# EasyEDA Pro project ProPrj_ProDocument_Button_Board_v3.0_2024-08-01_2024-12-14.epro

# Schematic Button_Board
Create Date: 2024-07-05; Page Name: P1; Project Name: MaiPico_IO_mini; Schematic Name: Button_Board; Update Date: 2024-07-05; Company: 嘉立创EDA; Page Size: A4; Version: V1.0
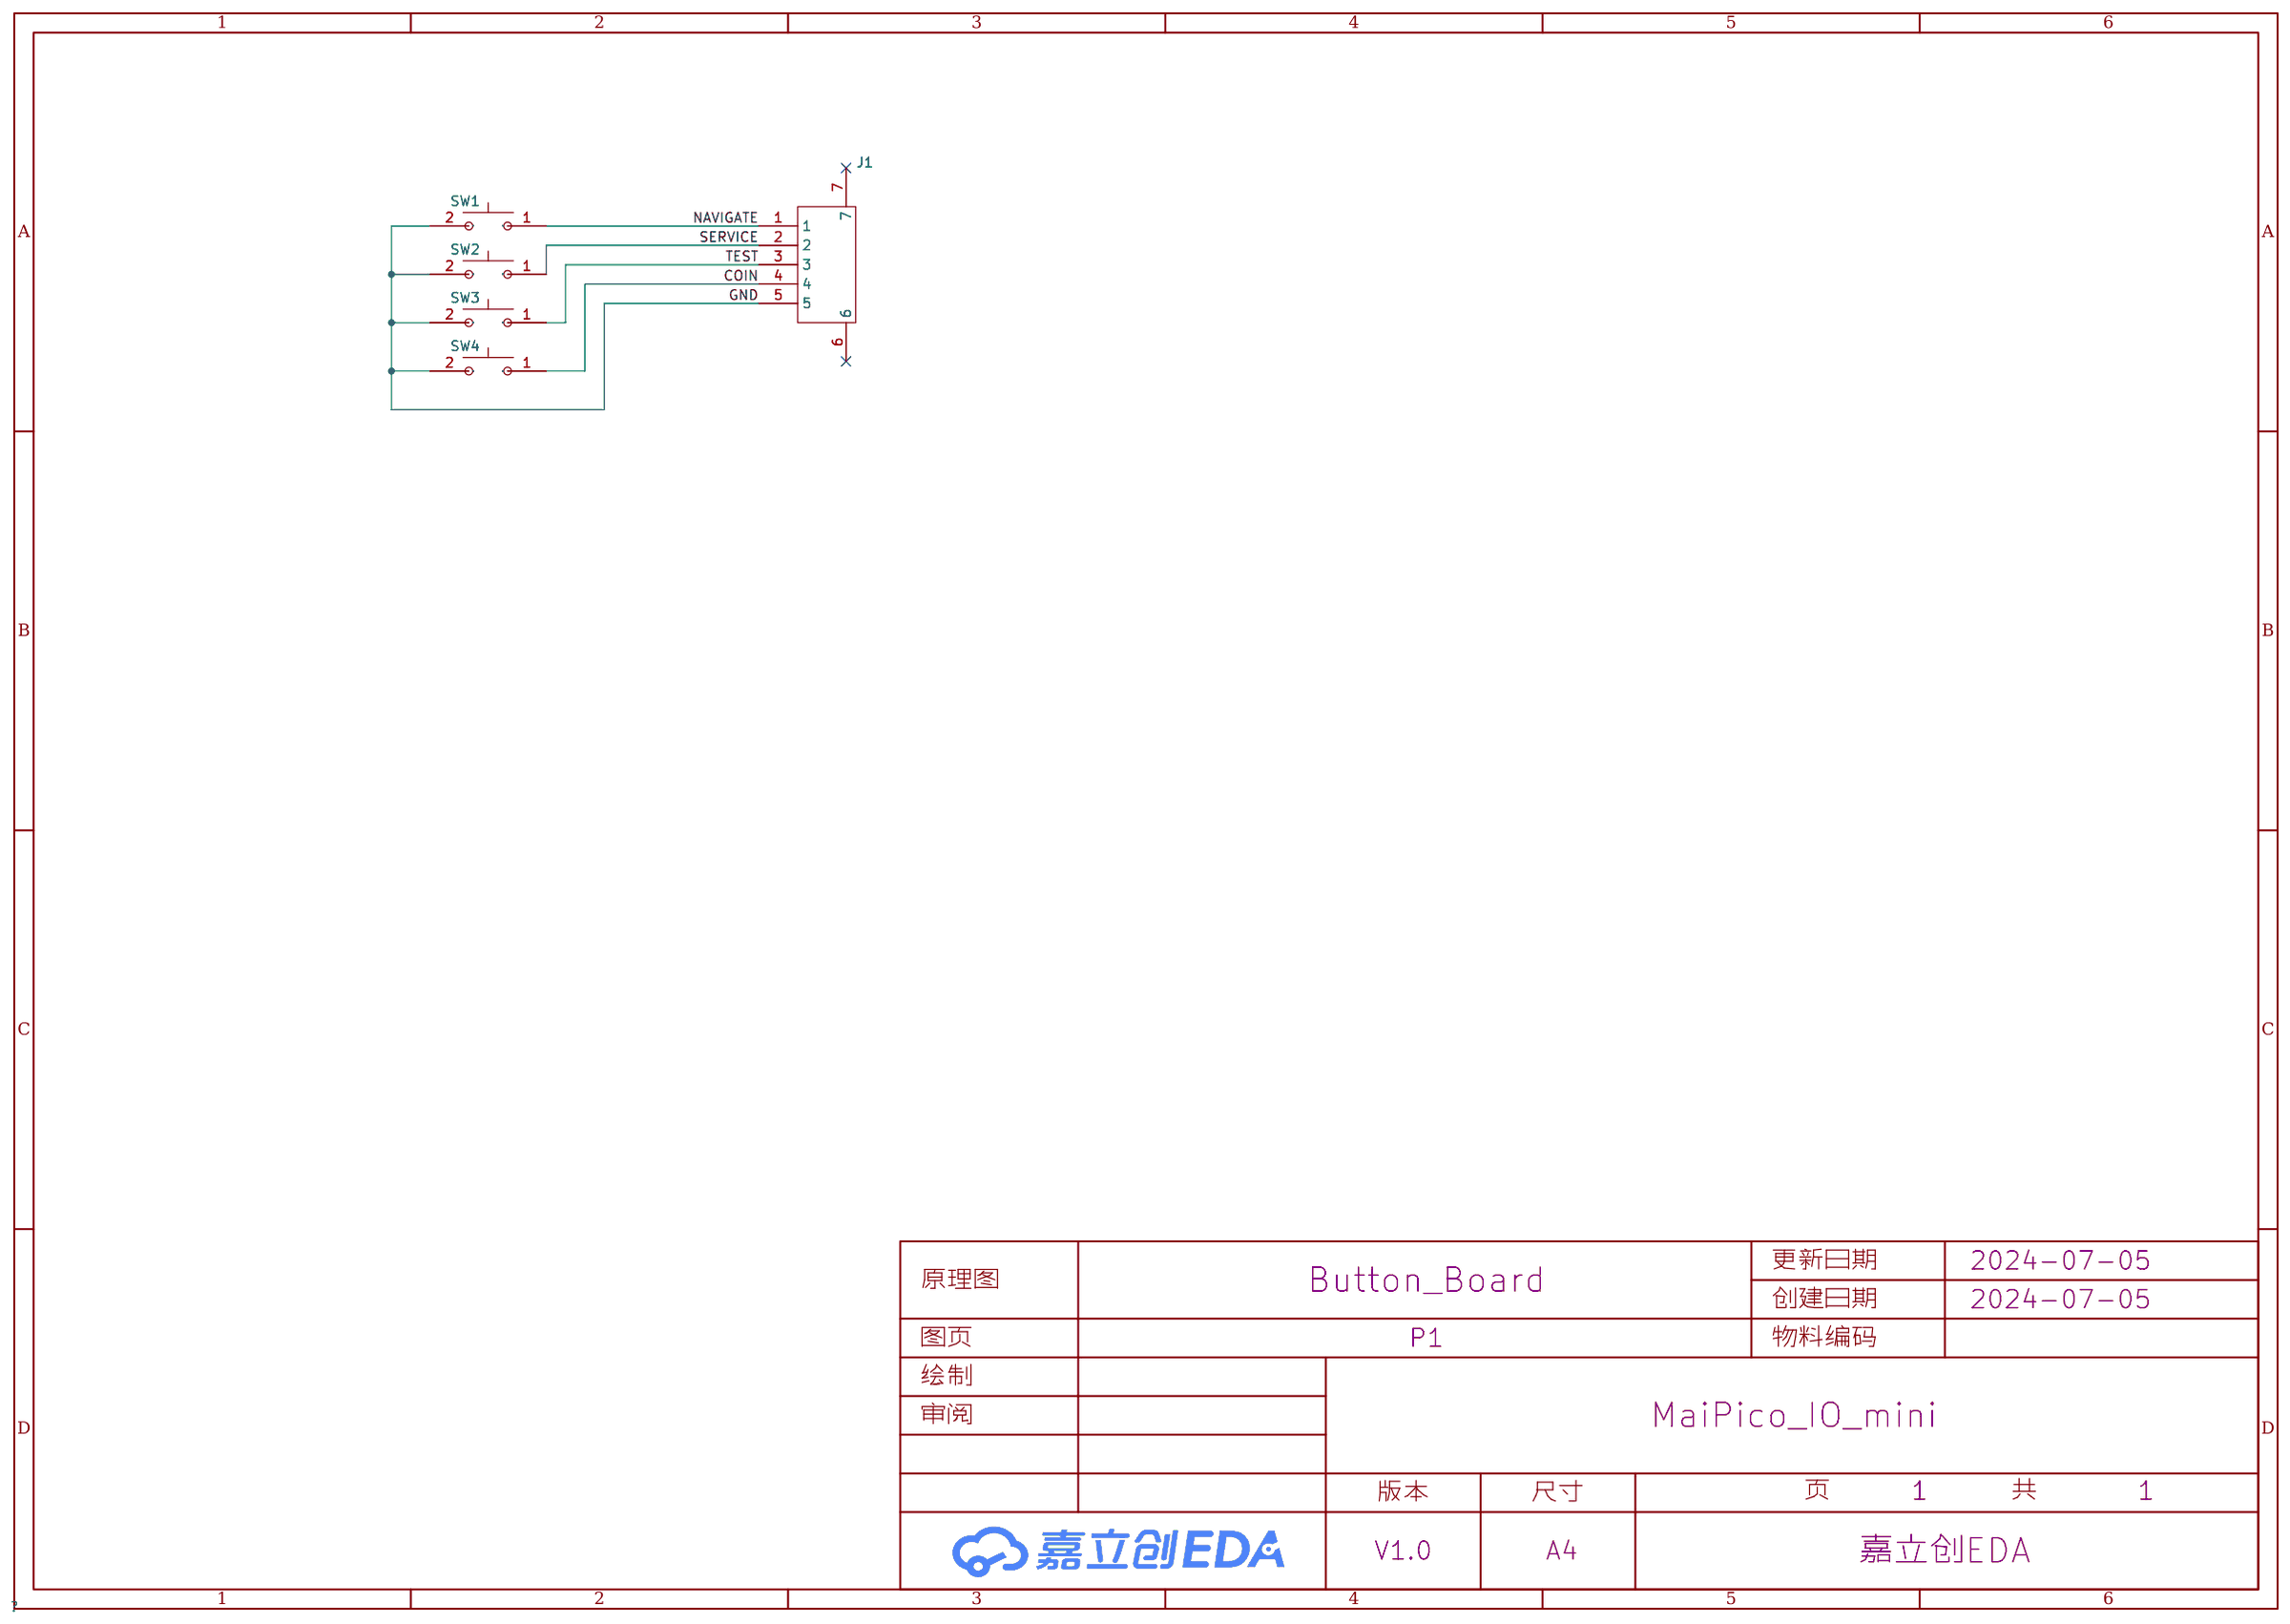
[diagram p0: schematic sheet]

## Parts
J1  AFA01-S05FCC-00  [FPC-SMD_P1.00-5P_FGS-XJ-H2.0]
SW1  1TS009B-2500-5000-CT  [SW-SMD_L6.0-W6.0-P6.00-LS6.6]
SW2  1TS009B-2500-5000-CT  [SW-SMD_L6.0-W6.0-P6.00-LS6.6]
SW3  1TS009B-2500-5000-CT  [SW-SMD_L6.0-W6.0-P6.00-LS6.6]
SW4  1TS009B-2500-5000-CT  [SW-SMD_L6.0-W6.0-P6.00-LS6.6]

## Library data of the parts
J1 = AFA01-S05FCC-00: 锁定特性:翻盖式;触点类型:下接;触点数量:5P;间距:1mm;安装类型:卧贴;; LCSC Part Name: 间距:1mm P数:5P 翻盖式 下接; Supplier Part: C262382; Manufacturer: JS(钜硕电子); Supplier Footprint: SMD,P=1mm,卧贴; JLCPCB Part Class: 扩展库; Datasheet: https://atta.szlcsc.com/upload/public/pdf/source/20180820/C262762_EBECD0847A529CA64FD00527F6604CA9.pdf; Supplier: LCSC; Locking Feature: 翻盖式; Contact Type: 下接; Number of Contacts: 5P; Pitch: 1mm; Mounting Type: 卧贴; FFC, FCB Thickness: 0.3mm; Height Above Board: 2mm
SW1-SW4 = 1TS009B-2500-5000-CT: 电路结构:单刀单掷;按钮形状:圆形按钮;作用力:250gf;安装方式:立贴;开关长度:6mm;开关宽度:6mm;开关高度:5mm;带支架:不带;触点电流:50mA;额定电压(DC):12V;额定功率:0.6W;绝缘电阻:100MΩ;带灯:无;机械寿命:10万次;; LCSC Part Name: 6*6*5mm 立贴 轻触开关; Supplier Part: C255816; Manufacturer: HYP(鸿源精密); Supplier Footprint: SMD,6x6mm; JLCPCB Part Class: 扩展库; Datasheet: https://atta.szlcsc.com/upload/public/pdf/source/20180720/C255816_1518C68253B0253C0472BEEB17FD7063.pdf; Supplier: LCSC; Circuit: 单刀单掷; Actuator Style: 圆形按钮; Operating Force: 250gf; Mounting Style: 立贴; Switch Length: 6mm; Switch Width: 6mm; Switch Height: 5mm; Strike Gundam: 不带; Contact Current: 50mA; Voltage Rating (DC): 12V; Power Rating: 0.6W; Insulation Resistance: 100MΩ; Actuator/Cap Color: 黑色; With Lamp: 无; Pin Style: J型引脚; Mechanical Life: 10万次; Operating Temperature: -40℃~+90℃

## Nets
GND: J1.5 SW1.2 SW2.2 SW3.2 SW4.2
COIN: J1.4 SW4.1
NAVIGATE: J1.1 SW1.1
SERVICE: J1.2 SW2.1
TEST: J1.3 SW3.1

Not connected (* = marked no-connect by the designer): J1 6* 7*

# Board Button_Board
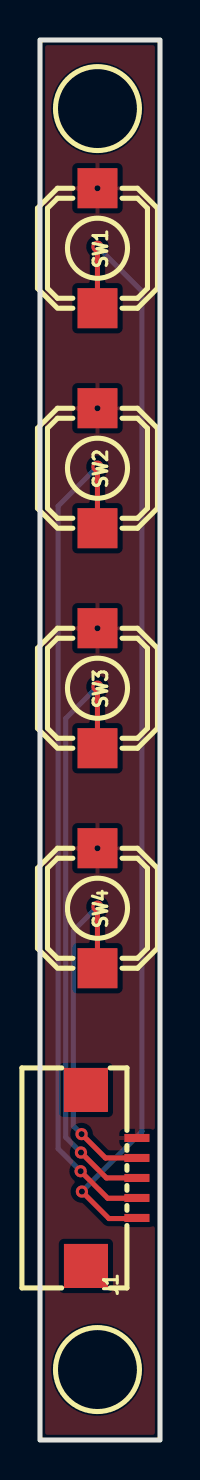
[diagram p1: board, top side]
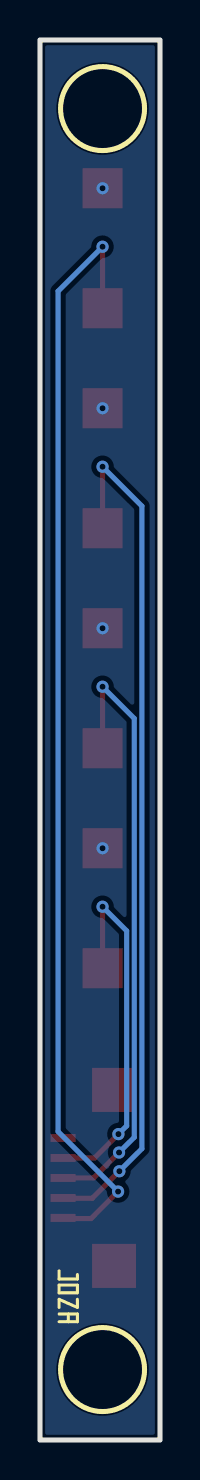
[diagram p2: board, bottom side, seen from below]

Outline 6 x 70 mm; copper layers: Top Layer, Bottom Layer. Coordinates in mm from the lower left corner of the outline.
Outline path: rectangle 0,70 6,0
Stack: Top Layer 0.035mm / Dielectric1 1.51mm FR4 er 4.5 / Bottom Layer 0.035mm

## Design rules (mm)
template: JLCPCB Capability(Two Layers Board)
spacing copperThickness1oz (default): track to track 0.102, other pairs 0.152 to 0.3
spacing copperThickness2oz: track to track 0.203, other pairs 0.152 to 0.3
track width copperThickness1oz (default): min 0.127, default 0.254, max 2.54
track width copperThickness2oz: min 0.203, default 0.254, max 2.54
differential pair differentialPair (default): width min 0.127, default 0.254, max 2.54; gap min 0.152, default 0.152
via viaSize (default): diameter min 0.5, default 0.61, max 10; hole min 0.3, default 0.305, max 6.3

## Placement (name value [footprint] x y rotation side)
J1  AFA01-S05FCC-00  [FPC-SMD_P1.00-5P_FGS-XJ-H2.0]  3.57 13.1 90 top
SW1  1TS009B-2500-5000-CT  [SW-SMD_L6.0-W6.0-P6.00-LS6.6]  2.87 59.59 90 top
SW2  1TS009B-2500-5000-CT  [SW-SMD_L6.0-W6.0-P6.00-LS6.6]  2.87 48.59 90 top
SW3  1TS009B-2500-5000-CT  [SW-SMD_L6.0-W6.0-P6.00-LS6.6]  2.87 37.59 90 top
SW4  1TS009B-2500-5000-CT  [SW-SMD_L6.0-W6.0-P6.00-LS6.6]  2.87 26.59 90 top

## Footprints (pads in the part's own frame, mm; a bottom-side part is the same pattern mirrored in y, then rotated)
FPC-SMD_P1.00-5P_FGS-XJ-H2.0
  rect 0.4x1.25 smd: 1(-2,-1.275) 2(-1.002,-1.274) 3(-0.002,-1.274) 4(0.998,-1.274) 5(1.998,-1.274)
  rect 2.2x2.2 smd: 6(4.4,1.275) 7(-4.4,1.275)
SW-SMD_L6.0-W6.0-P6.00-LS6.6
  rect 2x2 smd: 1(-3,0) 2(3,0)

## Nets
As in the schematic.

Pads without a net: J1 6 7

## Via types
v1: diameter 0.61, hole 0.305, Top Layer to Bottom Layer, 12 vias

## Routing (per net, layer and track width the routed paths; a pad name or vN(x,y) marks a point on that pad's centre or on a via; arc(x,y) is an arc through that point)
GND:
  vias: v1(2.87,62.59) v1(2.87,51.59) v1(2.87,40.59) v1(2.87,29.59)
COIN: length 18.6
  Top Layer w0.254: 5.1,14.1 J1.4 3.27,14.1 v1(2.08,15.29) ; v1(2.87,26.66) SW4.1
  Bottom Layer w0.254: v1(2.87,26.66) 1.67,25.46 1.67,15.71 v1(2.08,15.29)
NAVIGATE: length 55.8
  Top Layer w0.254: J1.1 4.81,11.07 3.45,11.07 v1(2.1,12.42) ; v1(2.87,59.66) SW1.1
  Bottom Layer w0.254: v1(2.1,12.42) 5.1,15.42 5.1,57.44 v1(2.87,59.66)
SERVICE: length 43
  Top Layer w0.254: v1(2.87,48.66) SW2.1 ; J1.2 4.83,12.09 3.38,12.09 v1(2.03,13.44)
  Bottom Layer w0.254: v1(2.03,13.44) 0.91,14.57 0.91,46.69 v1(2.87,48.66)
TEST: length 30.7
  Top Layer w0.254: J1.3 4.84,13.1 3.32,13.1 v1(2.05,14.37) ; v1(2.87,37.66) SW3.1
  Bottom Layer w0.254: v1(2.87,37.66) 1.29,36.08 1.29,15.14 v1(2.05,14.37)

## Copper pours and planes (outline as drawn; the poured copper is in the pictures)
GND on Top Layer: -7.35,93.5 11.45,93.5 11.45,-19.41 -7.35,-19.41
GND on Bottom Layer: -5.06,75.97 7.89,75.97 7.89,-1.5 -5.06,-1.5
